# Altium project Gate Driver Board.PrjPcb
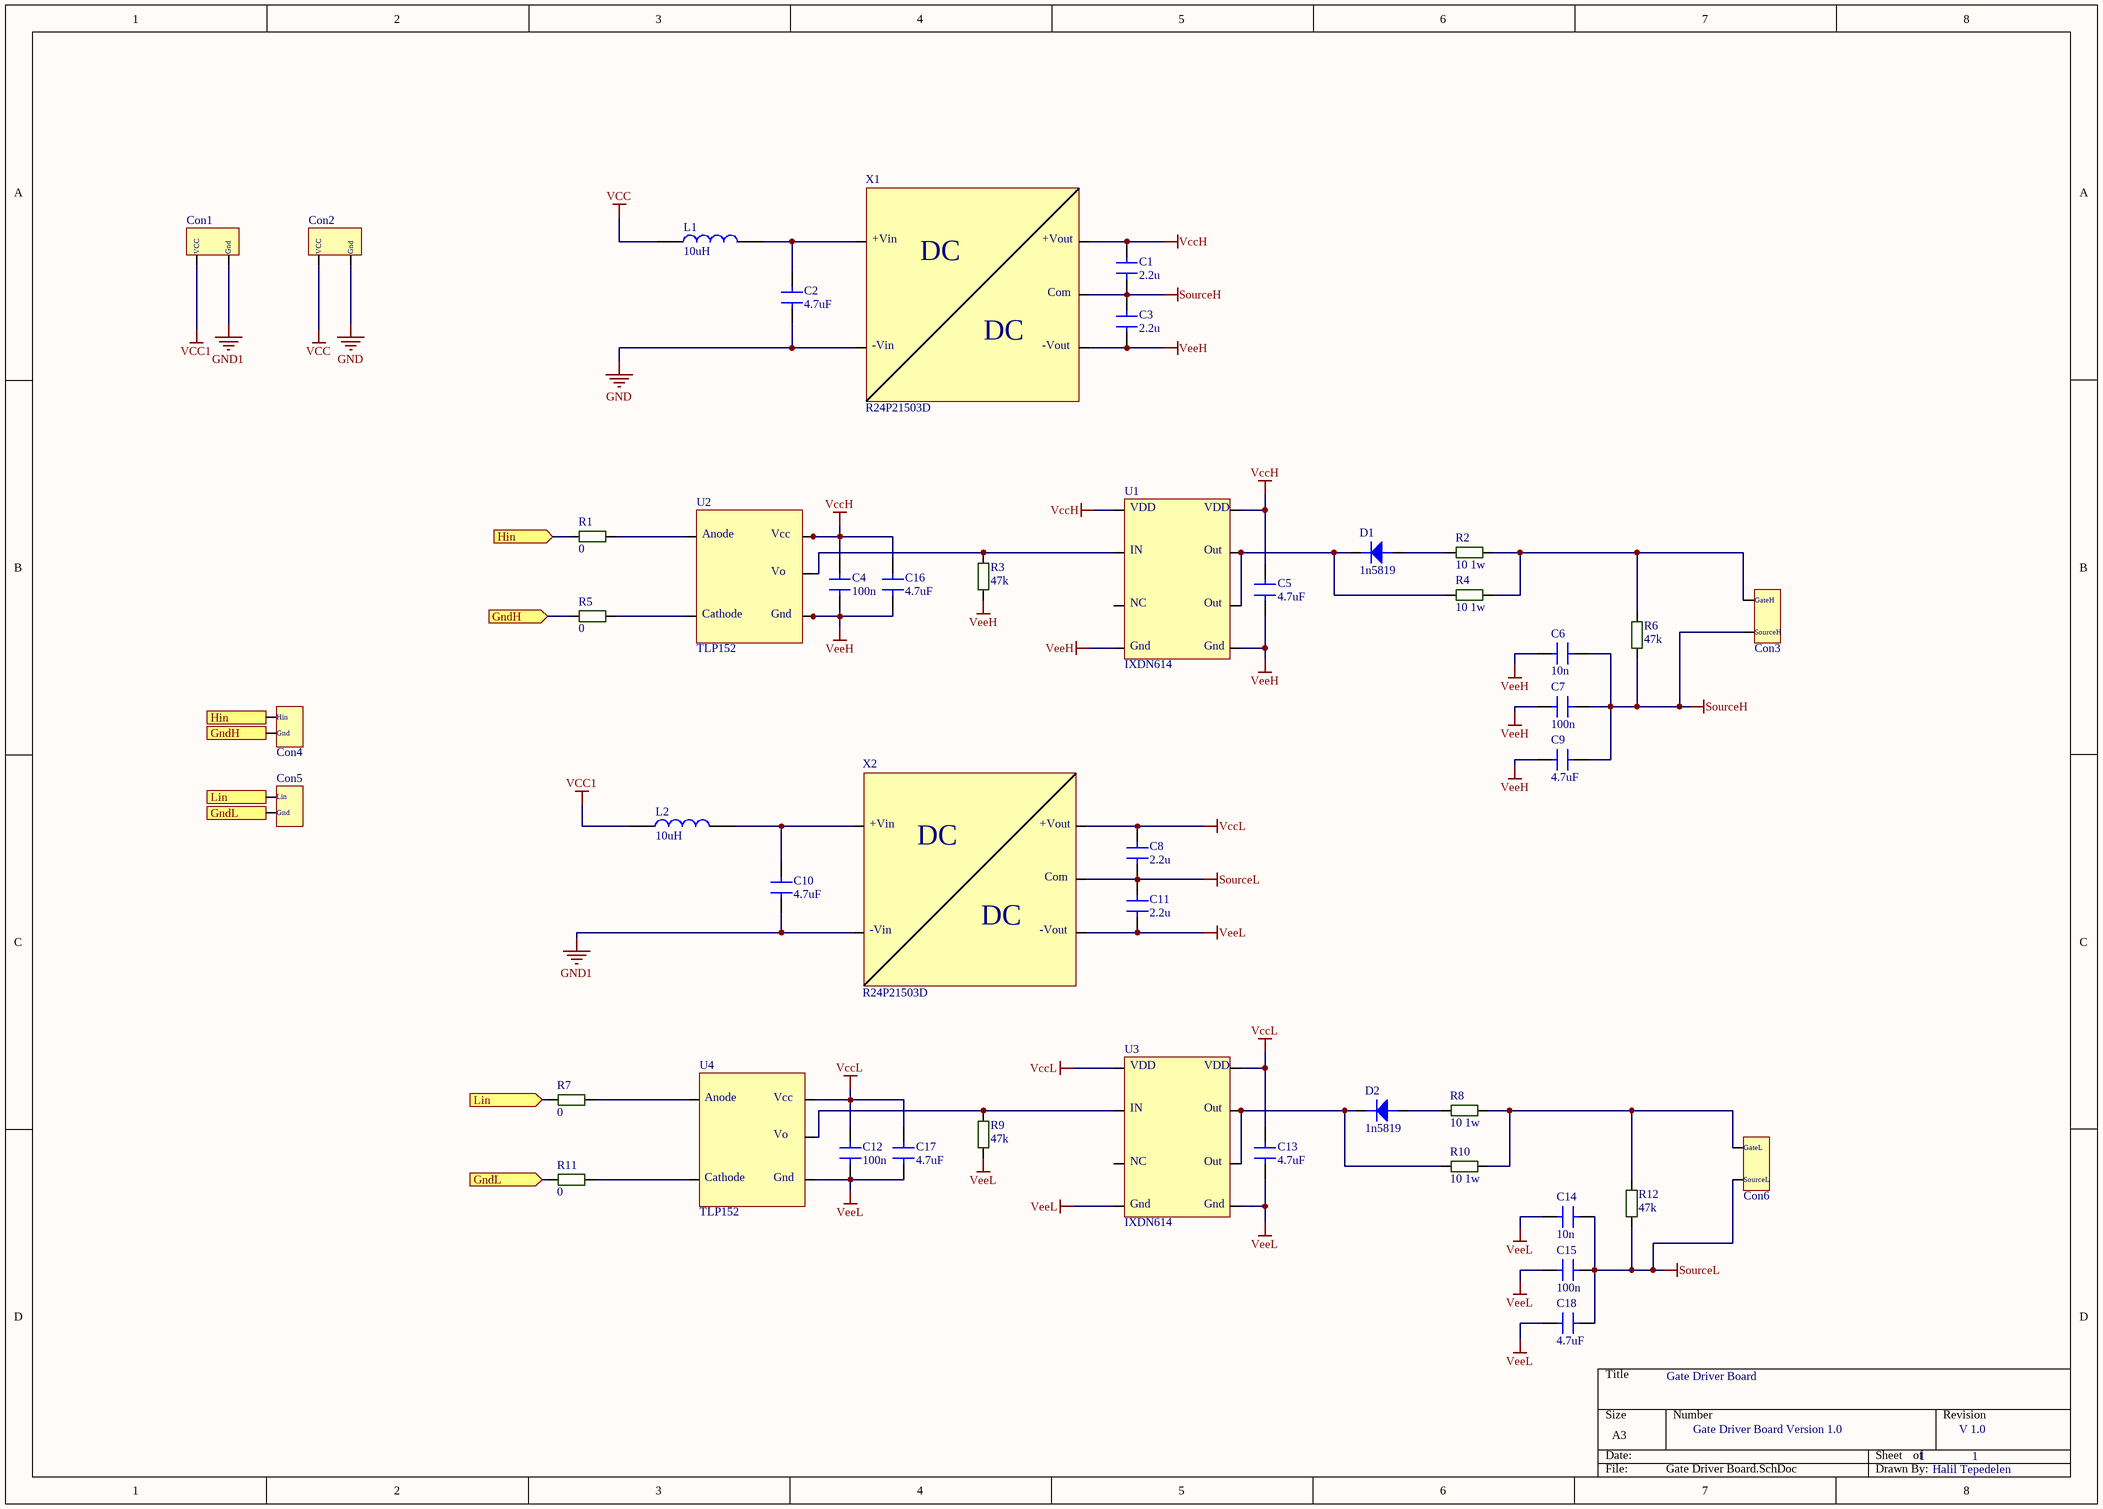
[diagram p0: Gate Driver Board.SchDoc]
1 sheet, 46 parts. Net scope: flat (ports and power ports of the same name join across sheets).
Board file: Gate Driver Board.PcbDoc

## Sheet Gate Driver Board.SchDoc
size A3

### Parts
C1  2.2u  [C-0805]
C2  4.7uF  [C-1206]
C3  2.2u  [C-0805]
C4  100n  [C-0805]
C5  4.7uF  [C-1206]
C6  10n  [C-0805]
C7  100n  [C-0805]
C8  2.2u  [C-0805]
C9  4.7uF  [C-1206]
C10  4.7uF  [C-1206]
C11  2.2u  [C-0805]
C12  100n  [C-0805]
C13  4.7uF  [C-1206]
C14  10n  [C-0805]
C15  100n  [C-0805]
C16  4.7uF  [C-1206]
C17  4.7uF  [C-1206]
C18  4.7uF  [C-1206]
Con1  Connector  [Conn]  (value not drawn)
Con2  Connector  [Conn]  (value not drawn)
Con3  Connector2_1  [Conn]  (value not drawn)
Con4  Connector2  [Conn]  (value not drawn)
Con5  Connector3  [Conn]  (value not drawn)
Con6  Connector2_2  [Conn]  (value not drawn)
D1  1n5819  [SOD123]
D2  1n5819  [SOD123]
L1  10uH  [WE-TPC_282892]
L2  10uH  [WE-TPC_282892]
R1  0  [R-0805]
R2  10 1w  [R-2512]
R3  47k  [R-0805]
R4  10 1w  [R-2512]
R5  0  [R-0805]
R6  47k  [R-0805]
R7  0  [R-0805]
R8  10 1w  [R-2512]
R9  47k  [R-0805]
R10  10 1w  [R-2512]
R11  0  [R-0805]
R12  47k  [R-0805]
U1  IXDN614  [FAN3122 Soic8]
U2  TLP152  [TLP152]
U3  IXDN614  [FAN3122 Soic8]
U4  TLP152  [TLP152]
X1  R24P21503D  [SIP7]
X2  R24P21503D  [SIP7]

### Ports
GndH (in), GndH (out), GndL (in), GndL (out), Hin (in), Hin (out), Lin (in), Lin (out)

### Nets
GND: C2.1 Con2.2 X1.2
GND1: C10.1 Con1.2 X2.2
SourceH: C1.1 C3.2 C6.1 C7.1 C9.2 Con3.2 R6.1 X1.6
SourceL: C8.1 C11.2 C14.1 C15.1 C18.2 Con6.2 R12.1 X2.6
VCC: Con2.1 L1.1
VCC1: Con1.1 L2.1
VccH: C1.2 C4.2 C5.2 C16.2 U1.1 U1.8 U2.5 X1.7
VccL: C8.2 C12.2 C13.2 C17.2 U3.1 U3.8 U4.5 X2.7
VeeH: C3.1 C4.1 C5.1 C6.2 C7.2 C9.1 C16.1 R3.1 U1.4 U1.5 U2.3 X1.5
VeeL: C11.1 C12.1 C13.1 C14.2 C15.2 C17.1 C18.1 R9.1 U3.4 U3.5 U4.3 X2.5
NetC2_2: C2.2 L1.2 X1.1
NetC10_2: C10.2 L2.2 X2.1
NetCon3_1: Con3.1 R2.2 R4.2 R6.2
NetCon4_1: Con4.1 R1.1 ; port Hin
NetCon4_2: Con4.2 R5.1 ; port GndH
NetCon5_1: Con5.1 R7.1 ; port Lin
NetCon5_2: Con5.2 R11.1 ; port GndL
NetCon6_1: Con6.1 R8.2 R10.2 R12.2
NetD1_a: D1.a R2.1
NetD1_k: D1.k R4.1 U1.6 U1.7
NetD2_a: D2.a R8.1
NetD2_k: D2.k R10.1 U3.6 U3.7
NetR1_2: R1.2 U2.1
NetR3_2: R3.2 U1.2 U2.4
NetR5_2: R5.2 U2.2
NetR7_2: R7.2 U4.1
NetR9_2: R9.2 U3.2 U4.4
NetR11_2: R11.2 U4.2

Not connected (* = marked no-connect by the designer): U1 3; U3 3

### Notes on the sheet
- Gate Driver Board
- Gate Driver Board Version 1.0
- 1
- V 1.0
- Halil Tepedelen
- (in symbol Connector) VCC; Gnd
- (in symbol Connector2) Hin; Gnd
- (in symbol Connector2_1) GateH; SourceH
- (in symbol Connector2_2) GateL; SourceL
- (in symbol Connector3) Lin; Gnd
- (in symbol IXDN614SITR) VDD; IN; Out; NC; Gnd
- (in symbol R24P21503D) +Vin; +Vout; DC; Com; -Vin; -Vout
- (in symbol TLP152(TPL,E) Anode; Vcc; Vo; Cathode; Gnd

### Library data of the parts
C1 C3 C8 C11 = C-0805: MLCC (2012) 0805 2.2uF 50VDC ±10% X5R; Manufacturer: SAMSUNG; Özdisan Part Number: CL21A225KBQNNNE; Price: 0,04880; Link: https://www.ozdisan.com/pasif-komponentler/kondansatorler/smd-kondansatorler-mlcc/CL21A225KBQNNNE
C2 C9 C10 C18 = Cap1206: MLCC (3216) 1206 4.7uF 50VDC ±10% X7R; Özdisan Part Number: CL31B475KBHNNNE; Manufacturer: SAMSUNG; Link: https://www.ozdisan.com/pasif-komponentler/kondansatorler/smd-kondansatorler-mlcc/CL31B475KBHNNNE; Price: 0,10407
C4 = C-0805: MLCC (2012) 0805 100nF 50VDC ±10% X7RMLCC (2012) 0805 100nF 50VDC ±10% X7R; Manufacturer: SAMSUNG; Özdisan Part Number: CL21B104KBCNNNC; Link: https://www.ozdisan.com/pasif-komponentler/kondansatorler/smd-kondansatorler-mlcc/CL21B104KBCNNNC; Price: 0,00844
C5 C13 C16 C17 = C-1206: MLCC (3216) 1206 4.7uF 50VDC ±10% X7R; Özdisan Part Number: CL31B475KBHNNNE; Manufacturer: SAMSUNG; Link: https://www.ozdisan.com/pasif-komponentler/kondansatorler/smd-kondansatorler-mlcc/CL31B475KBHNNNE; Price: 0,10407
C6 = C-0805: MLCC (2012) 0805 10nF 50VDC ±10% X7R; Manufacturer: SAMSUNG; Özdisan Part Number: CL21B103KBANNNL; Price: 0,01257; Link: https://www.ozdisan.com/pasif-komponentler/kondansatorler/smd-kondansatorler-mlcc/CL21B103KBANNNL
C7 C12 C15 = C-0805: MLCC (2012) 0805 100nF 50VDC ±10% X7R; Özdisan Part Number: CL21B104KBCNNNC; Manufacturer: SAMSUNG; Price: 0,00844; Link: https://www.ozdisan.com/pasif-komponentler/kondansatorler/smd-kondansatorler-mlcc/CL21B104KBCNNNC
C14 = C-0805: MLCC (2012) 0805 10nF 50VDC ±10% X7R; Özdisan Part Number: CL21B103KBANNNL; Manufacturer: SAMSUNG; Link: https://www.ozdisan.com/pasif-komponentler/kondansatorler/smd-kondansatorler-mlcc/CL21B103KBANNNL; Price: 0,01257
Con1 Con2 = Connector: PIN HEADER 40PIN(1x40) 2.54mm THT V/T; Özdisan Part Number: KLS1-207-1-40-S-3X9.5X15; Manufacturer: KLS ELECTRONIC; Link: https://www.ozdisan.com/konnektor-baglanti-elemanlari/headers/pin-header/KLS1-207-1-40-S-3X9-5X15; Price: 0,17227
Con3 = Connector2_1: PIN HEADER 40PIN(1x40) 2.54mm THT V/T; Özdisan Part Number: KLS1-207-1-40-S-3X9.5X15; Manufacturer: KLS ELECTRONIC; Price: 0,17227; Link: https://www.ozdisan.com/konnektor-baglanti-elemanlari/headers/pin-header/KLS1-207-1-40-S-3X9-5X15
Con4 = Connector2: PIN HEADER 40PIN(1x40) 2.54mm THT V/T; Özdisan Part Number: KLS1-207-1-40-S-3X9.5X15; Manufacturer: KLS ELECTRONIC; Price: 0,17227; Link: https://www.ozdisan.com/konnektor-baglanti-elemanlari/headers/pin-header/KLS1-207-1-40-S-3X9-5X15
Con5 = Connector3: PIN HEADER 40PIN(1x40) 2.54mm THT V/T; Özdisan Part Number: KLS1-207-1-40-S-3X9.5X15; Manufacturer: KLS ELECTRONIC; Link: https://www.ozdisan.com/konnektor-baglanti-elemanlari/headers/pin-header/KLS1-207-1-40-S-3X9-5X15; Price: 0,17227
Con6 = Connector2_2: PIN HEADER 40PIN(1x40) 2.54mm THT V/T; Özdisan Part Number: KLS1-207-1-40-S-3X9.5X15; Manufacturer: KLS ELECTRONIC; Price: 0,17227; Link: https://www.ozdisan.com/konnektor-baglanti-elemanlari/headers/pin-header/KLS1-207-1-40-S-3X9-5X15
D1 = 1N4148W-E3-18: DIODE SCHOTTKY 1A 40V SOD123; Manufacturer: HOTTECH; Özdisan Part Number: B5819W; ComponentLink1URL: https://datasheet.ciiva.com/29885/1n4148w-29885941.pdf?src-supplier=Avnet; ComponentLink1Description: https://datasheet.ciiva.com/29885/1n4148w-29885941.pdf?src-supplier=Avnet; ComponentLink2URL: https://datasheet.ciiva.com/29593/1n4148w-29593113.pdf?src-supplier=Digi-Key; ComponentLink2Description: https://datasheet.ciiva.com/29593/1n4148w-29593113.pdf?src-supplier=Digi-Key; ComponentLink3URL: https://datasheet.ciiva.com/29593/1n4148w-29593111.pdf?src-supplier=Digi-Key; ComponentLink3Description: https://datasheet.ciiva.com/29593/1n4148w-29593111.pdf?src-supplier=Digi-Key; ComponentLink4URL: https://datasheet.ciiva.com/29593/1n4148w-29593112.pdf?src-supplier=Digi-Key; ComponentLink4Description: https://datasheet.ciiva.com/29593/1n4148w-29593112.pdf?src-supplier=Digi-Key; Link: https://www.ozdisan.com/guc-yari-iletkenleri/diyot-modul-diyot-dogrultucular/schottky-diyotlar/B5819W; Price: 0,04258
D2 = 1N4148W-E3-18: Diode Small Signal Switching 100V 0.15A 2-Pin SOD-123 T/R; Özdisan Part Number: B5819W; Manufacturer: HOTTECH; ComponentLink1URL: https://datasheet.ciiva.com/29885/1n4148w-29885941.pdf?src-supplier=Avnet; ComponentLink1Description: https://datasheet.ciiva.com/29885/1n4148w-29885941.pdf?src-supplier=Avnet; ComponentLink2URL: https://datasheet.ciiva.com/29593/1n4148w-29593113.pdf?src-supplier=Digi-Key; ComponentLink2Description: https://datasheet.ciiva.com/29593/1n4148w-29593113.pdf?src-supplier=Digi-Key; ComponentLink3URL: https://datasheet.ciiva.com/29593/1n4148w-29593111.pdf?src-supplier=Digi-Key; ComponentLink3Description: https://datasheet.ciiva.com/29593/1n4148w-29593111.pdf?src-supplier=Digi-Key; ComponentLink4URL: https://datasheet.ciiva.com/29593/1n4148w-29593112.pdf?src-supplier=Digi-Key; ComponentLink4Description: https://datasheet.ciiva.com/29593/1n4148w-29593112.pdf?src-supplier=Digi-Key; Price: 0,04258; Link: https://www.ozdisan.com/guc-yari-iletkenleri/diyot-modul-diyot-dogrultucular/schottky-diyotlar/B5819W
L1 L2 = inductor: INDUCTOR POWER 10UH 2.8X2.8X2.8MM SMD; Özdisan Part Number: 744025100; Manufacturer: WURTH; Link: https://www.ozdisan.com/pasif-komponentler/induktorler/sabit-induktor/744025100; Price: 0,74325
R1 R5 R11 = Res0805: RES.(2012) 0805 0 Ohms 5% 1/8W-S 800PPM; Manufacturer: ROYALOHM; Özdisan Part Number: 0805S8J0000T5E; Link: https://www.ozdisan.com/pasif-komponentler/direncler/smt-smd-direncler/0805S8J0000T5E; Price: 0,00234
R2 R10 = R-2512: RES.(6432) 2512 5.1 Ohms 5% 1W 400PPM; Manufacturer: ROYALOHM; Özdisan Part Number: 25121WJ051JT4E; Price: 0,02294; Link: https://www.ozdisan.com/pasif-komponentler/direncler/smt-smd-direncler/25121WJ051JT4E
R3 = Res0805: RES.(2012) 0805 47K Ohms 5% 1/8W-S 100PPM; Manufacturer: ROYALOHM; Özdisan Part Number: 0805S8J0473T5E; Link: https://www.ozdisan.com/pasif-komponentler/direncler/smt-smd-direncler/0805S8J0473T5E; Price: 0,00234
R4 R8 = R-2512: RES.(6432) 2512 5.1 Ohms 5% 1W 400PPM; Özdisan Part Number: 25121WJ051JT4E; Manufacturer: ROYALOHM; Price: 0,02294; Link: https://www.ozdisan.com/pasif-komponentler/direncler/smt-smd-direncler/25121WJ051JT4E
R6 R9 R12 = Res0805: RES.(2012) 0805 47K Ohms 5% 1/8W-S 100PPM; Özdisan Part Number: 0805S8J0473T5E; Manufacturer: ROYALOHM; Link: https://www.ozdisan.com/pasif-komponentler/direncler/smt-smd-direncler/0805S8J0473T5E; Price: 0,00234
R7 = Res0805: RES.(2012) 0805 0 Ohms 5% 1/8W-S 800PPM; Özdisan Part Number: 0805S8J0000T5E; Manufacturer: ROYALOHM; Price: 0,00234; Link: https://www.ozdisan.com/pasif-komponentler/direncler/smt-smd-direncler/0805S8J0000T5E
U1 U3 = IXDN614SITR: IC-614 DRIVER MOSFET/IGBT SOIC8 IXYS CLARE; ComponentLink1URL: https://datasheet.ciiva.com/6613/ixd-614-6613145.pdf?src-supplier=Digi-Key; ComponentLink1Description: https://datasheet.ciiva.com/6613/ixd-614-6613145.pdf?src-supplier=Digi-Key; Link: https://www.ozdisan.com/entegre-devreler-ics/guc-entegreleri/ic-guc-surucu-entegreleri/IXDN614SI; Manufacturer: IXYS CLARE; Price: 3,90467; Özdisan Part Number: IXDN614SI
U2 U4 = TLP152(TPL,E: IC-152 PHOTOCOUPLER GATE DRIVE SO6 TOSHIBA; ComponentLink1URL: https://datasheet.ciiva.com/41848/tlp152-datasheet-en-20120914-41848928.pdf?src-supplier=Digi-Key; ComponentLink1Description: https://datasheet.ciiva.com/41848/tlp152-datasheet-en-20120914-41848928.pdf?src-supplier=Digi-Key; Özdisan Part Number: TLP152(TPL,E; Link: https://www.ozdisan.com/optolar-sensorler/optolar/gate-surucu-optokuplorleri/TLP152TPLE; Manufacturer: TOSHIBA; Price: 0,80155
X1 = R24P21503D: DC/DC CONV 2W 12VDC +15/-3VDC 93mA/-185mA SIP7; Manufacturer: RECOM; Özdisan Part Number: R12P21503D; Link: https://www.ozdisan.com/guc-kaynaklari-adaptorler/izole-donusturucu-moduller/dcdc-donusturuculer/R12P21503D; Price: 11,27149
X2 = R24P21503D: DC/DC CONV 2W 12VDC +15/-3VDC 93mA/-185mA SIP7; Manufacturer: RECOM; Özdisan Part NUMBER: R12P21503D; Price: 11,27149; Link: https://www.ozdisan.com/guc-kaynaklari-adaptorler/izole-donusturucu-moduller/dcdc-donusturuculer/R12P21503D